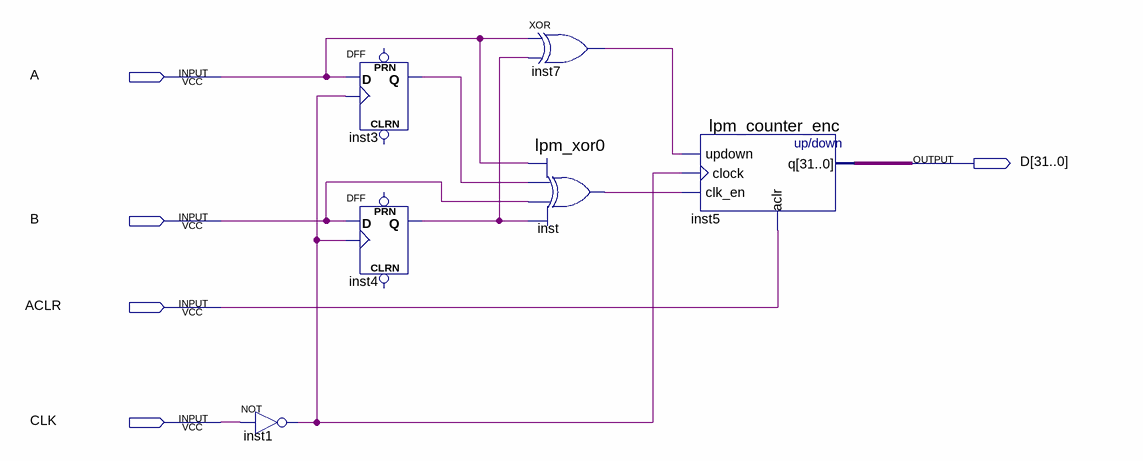
[diagram p0: schematic sheet]
// Quartus schematic encoder_counter.bdf as structural Verilog: 6 symbols, 5 pins
module encoder_counter (
  input  A,
  input  B,
  input  ACLR,
  input  CLK,
  output [31:0] D
);

  wire inst1_out, inst3_q, inst4_q, inst7_out, inst_result;

  not inst1 (inst1_out, CLK);
  DFF inst3 (.CLK(inst1_out), .D(A), .Q(inst3_q));  // open: CLRN, PRN
  DFF inst4 (.CLK(inst1_out), .D(B), .Q(inst4_q));  // open: CLRN, PRN
  xor inst7 (inst7_out, A, inst4_q);
  lpm_xor0 inst (.data0(A), .data1(inst3_q), .data2(B), .data3(inst4_q), .result(inst_result));
  lpm_counter_enc inst5 (.updown(inst7_out), .clock(inst1_out), .clk_en(inst_result), .aclr(ACLR), .q(D));
endmodule
